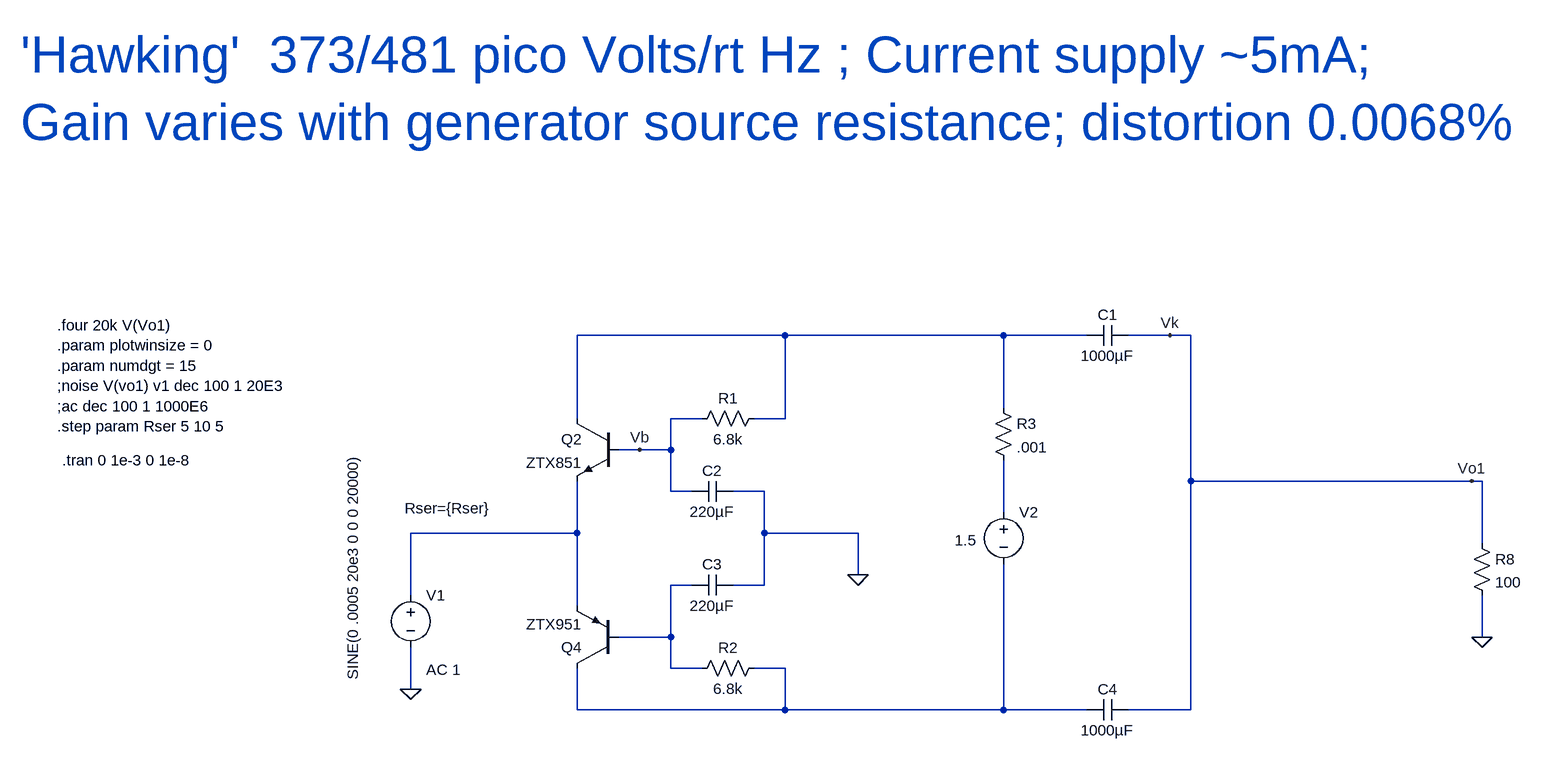
[diagram p0: schematic Hawking.asc]
Hawking.asc, the LTspice schematic file:
Version 4
SHEET 1 3280 680
WIRE 832 -144 512 -144
WIRE 1168 -144 832 -144
WIRE 1296 -144 1168 -144
WIRE 1424 -144 1360 -144
WIRE 1456 -144 1424 -144
WIRE 1168 -32 1168 -144
WIRE 512 -16 512 -144
WIRE 704 -16 656 -16
WIRE 832 -16 832 -144
WIRE 832 -16 784 -16
WIRE 608 32 576 32
WIRE 656 32 656 -16
WIRE 656 32 608 32
WIRE 1456 80 1456 -144
WIRE 1888 80 1456 80
WIRE 1904 80 1888 80
WIRE 656 96 656 32
WIRE 688 96 656 96
WIRE 800 96 752 96
WIRE 1168 128 1168 48
WIRE 512 160 512 80
WIRE 512 160 256 160
WIRE 800 160 800 96
WIRE 944 160 800 160
WIRE 1904 176 1904 80
WIRE 944 224 944 160
WIRE 688 240 656 240
WIRE 800 240 800 160
WIRE 800 240 752 240
WIRE 256 256 256 160
WIRE 512 272 512 160
WIRE 656 320 656 240
WIRE 656 320 576 320
WIRE 1904 320 1904 256
WIRE 656 368 656 320
WIRE 704 368 656 368
WIRE 832 368 784 368
WIRE 256 400 256 336
WIRE 512 432 512 368
WIRE 832 432 832 368
WIRE 832 432 512 432
WIRE 1168 432 1168 208
WIRE 1168 432 832 432
WIRE 1296 432 1168 432
WIRE 1456 432 1456 80
WIRE 1456 432 1360 432
FLAG 1888 80 Vo1
FLAG 256 400 0
FLAG 944 224 0
FLAG 1904 320 0
FLAG 608 32 Vb
FLAG 1424 -144 Vk
SYMBOL voltage 256 240 R0
WINDOW 3 -89 -203 VRight 2
WINDOW 123 24 130 Left 2
WINDOW 39 -9 -118 Left 2
SYMATTR Value SINE(0 .0005 20e3 0 0 0 20000)
SYMATTR Value2 AC 1
SYMATTR SpiceLine Rser={Rser}
SYMATTR InstName V1
SYMBOL voltage 1168 112 R0
WINDOW 3 -75 59 Left 2
WINDOW 123 24 130 Left 2
WINDOW 39 0 0 Left 2
SYMATTR Value 1.5
SYMATTR InstName V2
SYMBOL res 1888 160 R0
SYMATTR InstName R8
SYMATTR Value 100
SYMBOL npn 576 -16 M0
SYMATTR InstName Q2
SYMATTR Value ZTX851
SYMBOL pnp 576 368 R180
SYMATTR InstName Q4
SYMATTR Value ZTX951
SYMBOL res 800 -32 R90
WINDOW 0 0 56 VBottom 2
WINDOW 3 32 56 VTop 2
SYMATTR InstName R1
SYMATTR Value 6.8k
SYMBOL res 800 352 R90
WINDOW 0 0 56 VBottom 2
WINDOW 3 32 56 VTop 2
SYMATTR InstName R2
SYMATTR Value 6.8k
SYMBOL cap 752 80 R90
WINDOW 0 0 32 VBottom 2
WINDOW 3 32 32 VTop 2
SYMATTR InstName C2
SYMATTR Value 220µF
SYMBOL cap 752 224 R90
WINDOW 0 0 32 VBottom 2
WINDOW 3 32 32 VTop 2
SYMATTR InstName C3
SYMATTR Value 220µF
SYMBOL cap 1360 -160 R90
WINDOW 0 0 32 VBottom 2
WINDOW 3 32 32 VTop 2
SYMATTR InstName C1
SYMATTR Value 1000µF
SYMBOL cap 1360 416 R90
WINDOW 0 0 32 VBottom 2
WINDOW 3 32 32 VTop 2
SYMATTR InstName C4
SYMATTR Value 1000µF
SYMBOL res 1152 -48 R0
SYMATTR InstName R3
SYMATTR Value .001
TEXT -280 48 Left 2 !.tran 0 1e-3 0 1e-8
TEXT -288 -160 Left 2 !.four 20k V(Vo1)\n.param plotwinsize = 0\n.param numdgt = 15\n;noise V(vo1) v1 dec 100 1 20E3\n;ac dec 100 1 1000E6\n.step param Rser 5 10 5
TEXT -344 -576 Left 6 ;'Hawking'  373/481 pico Volts/rt Hz ; Current supply ~5mA; \nGain varies with generator source resistance; distortion 0.0068%

The netlist it stands for:
* Hawking.asc
V1 N003 0 SINE(0 .0005 20e3 0 0 0 20000) AC 1 Rser={Rser}
V2 N002 N005 1.5
R8 Vk 0 100
Q2 N001 Vb N003 0 ZTX851
Q4 N005 N004 N003 0 ZTX951
R1 N001 Vb 6.8k
R2 N005 N004 6.8k
C2 0 Vb 220µF
C3 0 N004 220µF
C1 Vk N001 1000µF
C4 Vk N005 1000µF
R3 N001 N002 .001
.model NPN NPN
.model PNP PNP
.lib standard.bjt
.tran 0 1e-3 0 1e-8
.four 20k V(Vo1)
.param plotwinsize = 0
.param numdgt = 15
;noise V(vo1) v1 dec 100 1 20E3
;ac dec 100 1 1000E6
.step param Rser 5 10 5
* 'Hawking'  373/481 pico Volts/rt Hz ; Current supply ~5mA;
* Gain varies with generator source resistance; distortion 0.0068%
.backanno
.end